# Altium schematic sheet WIFI_BLE.SchDoc
size A2; DrawnBy: UKAYACIK; Engineer: UKAYACIK; DocumentNumber: 19; Revision: B; SheetNumber: 19; SheetTotal: 21
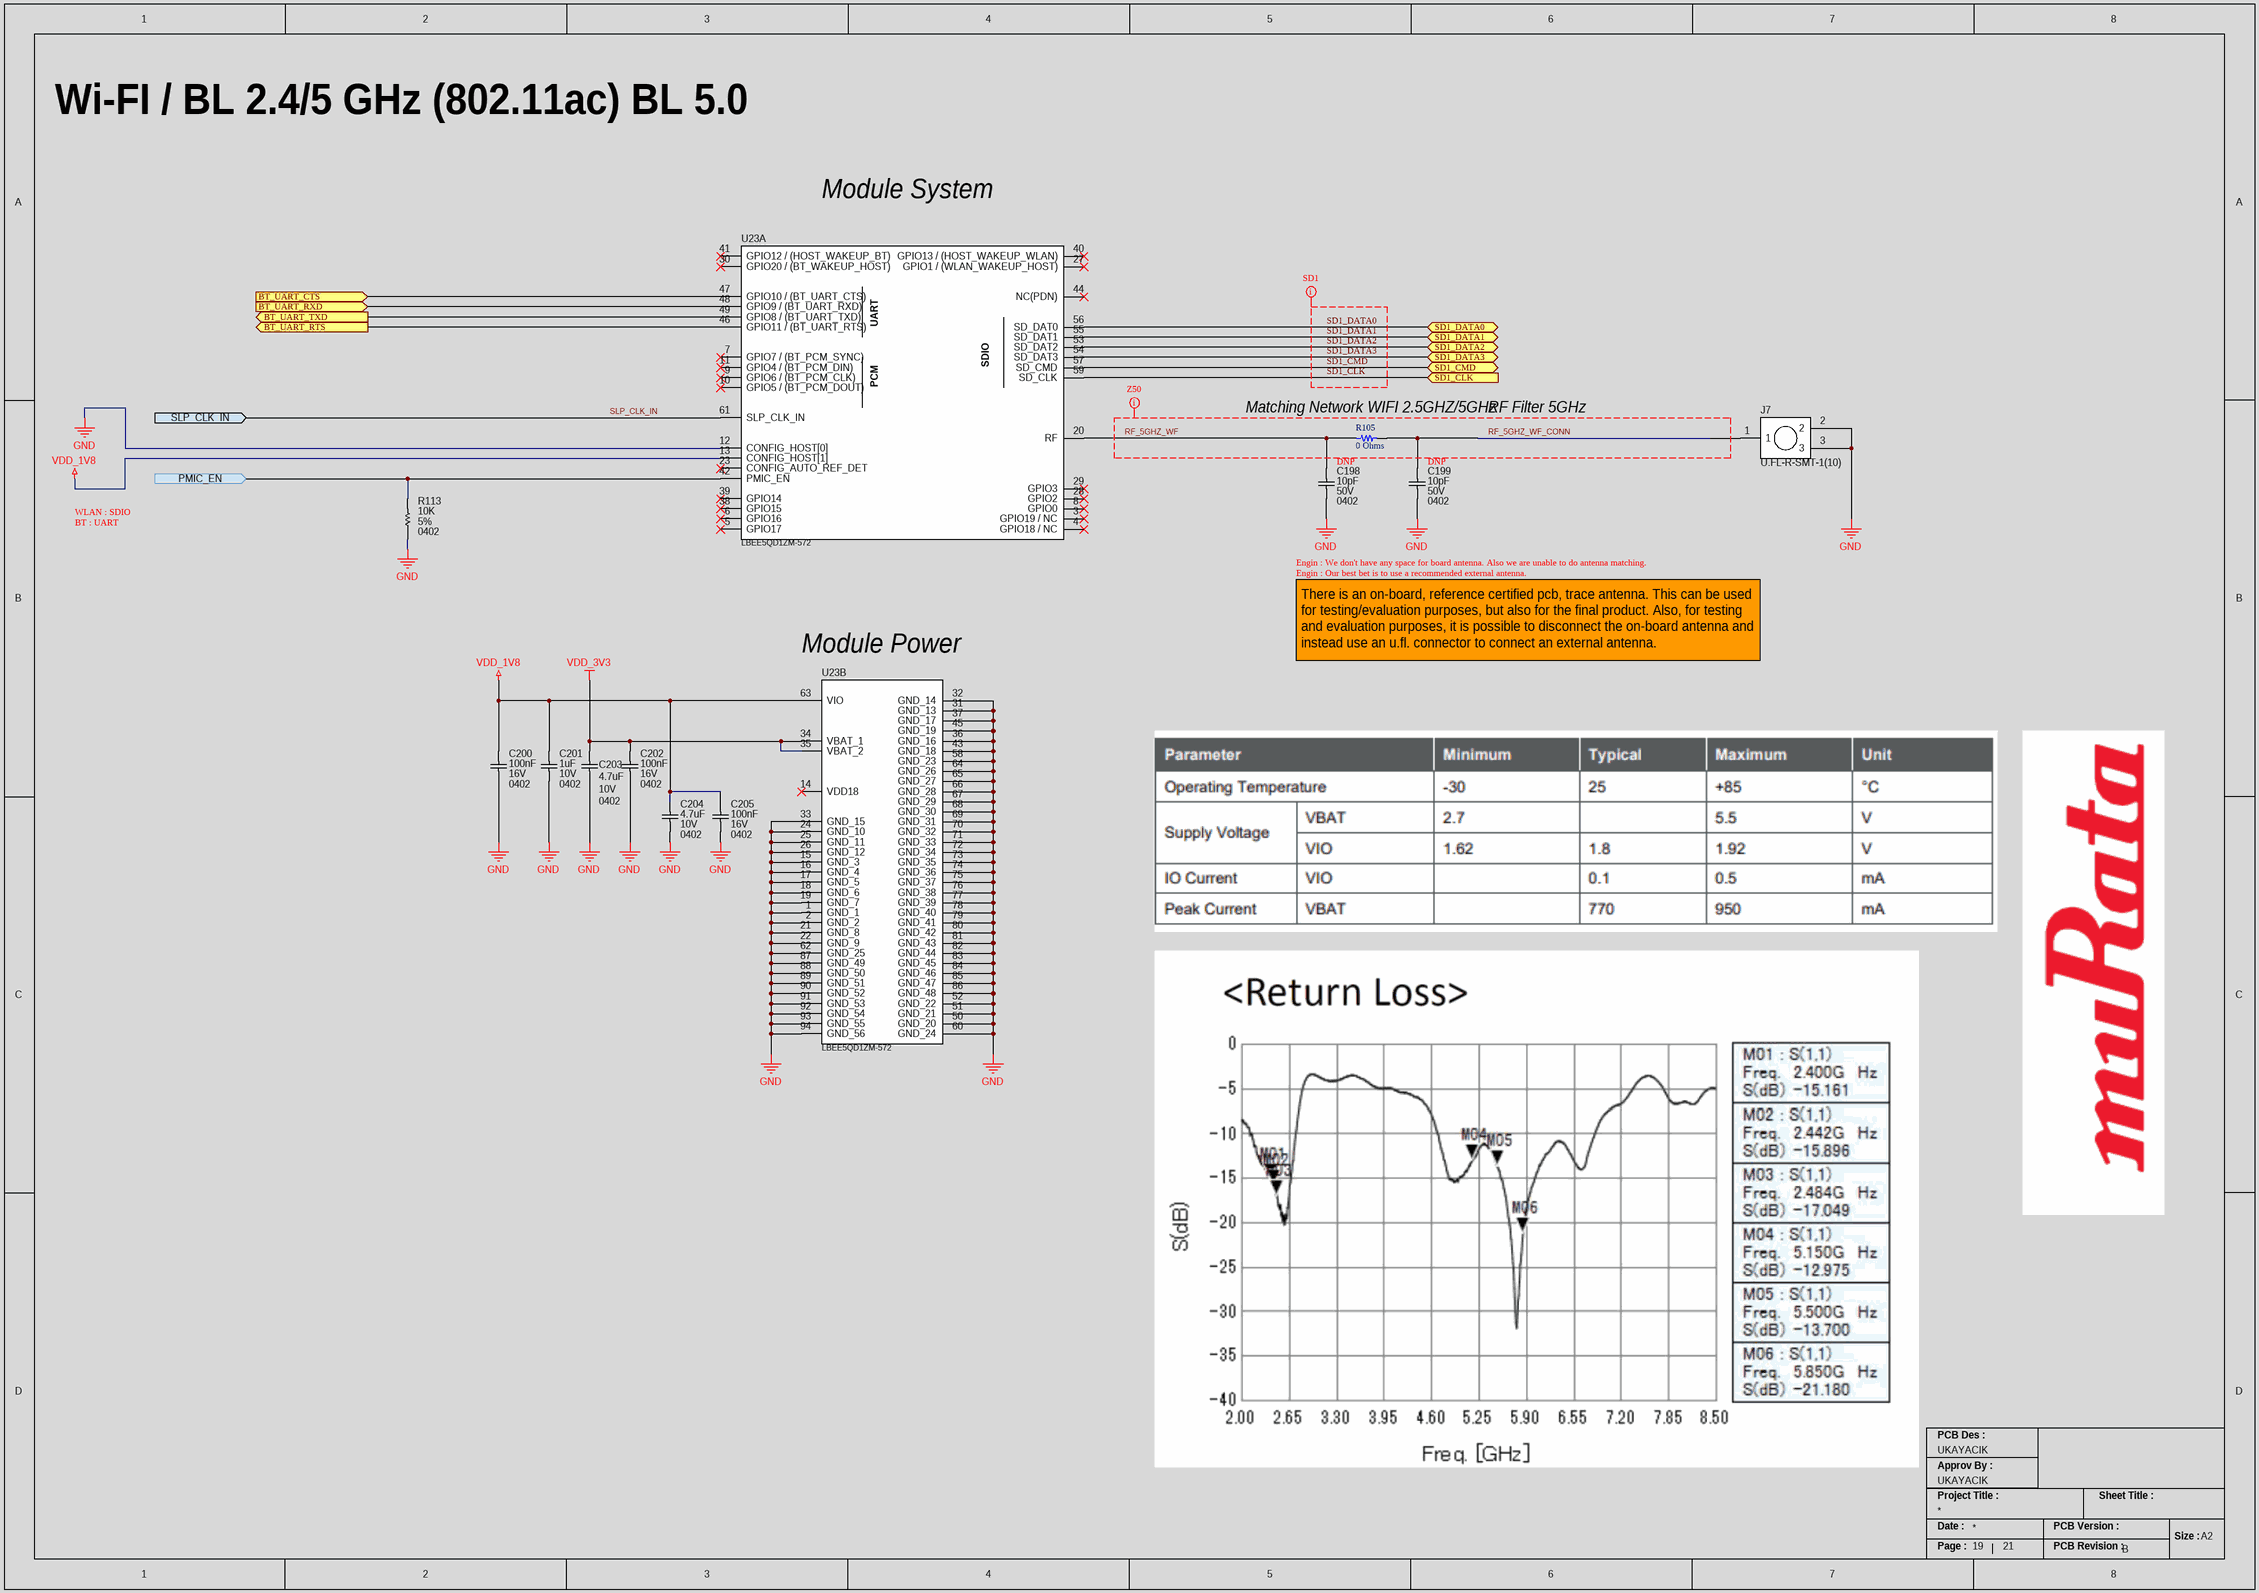
[diagram p0: WIFI_BLE.SchDoc]

## Parts
C198  Case/Package: 0402  Voltage Rating: 50V  Capacitance: 10pF  [CAP_0402_CAPC1005X05N]  (hidden comment: GJM1555C1H100FB01D)
C199  Case/Package: 0402  Voltage Rating: 50V  Capacitance: 10pF  [CAP_0402_CAPC1005X05N]  (hidden comment: GJM1555C1H100FB01D)
C200  Voltage Rating: 16V  Capacitance: 100nF  Case/Package: 0402  [CAP_0402_CAPC1005X05N]  (hidden comment: CL05B104KO5NNNC)
C201  Voltage Rating: 10V  Capacitance: 1uF  Case/Package: 0402  [CAP_0402_CAPC1005X05N]  (hidden comment: GRM155C81A105KA12D)
C202  Voltage Rating: 16V  Capacitance: 100nF  Case/Package: 0402  [CAP_0402_CAPC1005X05N]  (hidden comment: CL05B104KO5NNNC)
C203  Capacitance: 4.7uF  Voltage Rating: 10V  Case/Package: 0402  [CAP_0402_CAPC1005X05N]  (hidden comment: CL05A475KP5NRNC)
C204  Capacitance: 4.7uF  Voltage Rating: 10V  Case/Package: 0402  [CAP_0402_CAPC1005X05N]  (hidden comment: CL05A475KP5NRNC)
C205  Voltage Rating: 16V  Capacitance: 100nF  Case/Package: 0402  [CAP_0402_CAPC1005X05N]  (hidden comment: CL05B104KO5NNNC)
J7  U.FL-R-SMT-1(10)  [CONN_UFL_U.FL-R-SMT-1(10)]
R105  0 Ohms  [RES 0402_1005]
R113  Tolerance: 5%  Resistance: 10K  Case/Package: 0402  [RES_0402_RESC1005X04N]  (hidden comment: ERJ-2GEJ103X)
U23  LBEE5QD1ZM-572  [IC_WIFI_BLE_LBEE5QD1ZM572]  (parts A,B of 2)

## Ports
BT_UART_CTS (in), BT_UART_RTS (out), BT_UART_RXD (in), BT_UART_TXD (out), PMIC_EN (in), SD1_CLK (in), SD1_CMD (bidir), SD1_DATA0 (bidir), SD1_DATA1 (bidir), SD1_DATA2 (bidir), SD1_DATA3 (bidir), SLP_CLK_IN (in)

## Nets
GND: C198.1 C199.1 C200.1 C201.1 C202.1 C203.1 C204.1 C205.1 J7.2 J7.3 R113.1 U23.1(GND_1) U23.2(GND_2) U23.12(CONFIG_HOST[0]) U23.15(GND_3) U23.16(GND_4) U23.17(GND_5) U23.18(GND_6) U23.19(GND_7) U23.21(GND_8) U23.22(GND_9) U23.24(GND_10) U23.25(GND_11) U23.26(GND_12) U23.31(GND_13) U23.32(GND_14) U23.33(GND_15) U23.36(GND_16) U23.37(GND_17) U23.43(GND_18) U23.45(GND_19) U23.50(GND_20) U23.51(GND_21) U23.52(GND_22) U23.58(GND_23) U23.60(GND_24) U23.62(GND_25) U23.64(GND_26) U23.65(GND_27) U23.66(GND_28) U23.67(GND_29) U23.68(GND_30) U23.69(GND_31) U23.70(GND_32) U23.71(GND_33) U23.72(GND_34) U23.73(GND_35) U23.74(GND_36) U23.75(GND_37) U23.76(GND_38) U23.77(GND_39) U23.78(GND_40) U23.79(GND_41) U23.80(GND_42) U23.81(GND_43) U23.82(GND_44) U23.83(GND_45) U23.84(GND_46) U23.85(GND_47) U23.86(GND_48) U23.87(GND_49) U23.88(GND_50) U23.89(GND_51) U23.90(GND_52) U23.91(GND_53) U23.92(GND_54) U23.93(GND_55) U23.94(GND_56)
VDD_1V8: C200.2 C201.2 C204.2 C205.2 U23.13(CONFIG_HOST[1]) U23.63(VIO)
VDD_3V3: C202.2 C203.2 U23.34(VBAT_1) U23.35(VBAT_2)
BT_UART_CTS: U23.47(GPIO10_/_(BT_UART_CTS)) ; port BT_UART_CTS
BT_UART_RTS: U23.46(GPIO11_/_(BT_UART_RTS)) ; port BT_UART_RTS
BT_UART_RXD: U23.48(GPIO9_/_(BT_UART_RXD)) ; port BT_UART_RXD
BT_UART_TXD: U23.49(GPIO8_/_(BT_UART_TXD)) ; port BT_UART_TXD
PMIC_EN: R113.2 U23.42(PMIC_EN) ; port PMIC_EN
RF_5GHZ_WF: C198.2 R105.1 U23.20(RF)
RF_5GHZ_WF_CONN: C199.2 J7.1 R105.2
SD1_CLK: U23.59(SD_CLK) ; port SD1_CLK
SD1_CMD: U23.57(SD_CMD) ; port SD1_CMD
SD1_DATA0: U23.56(SD_DAT0) ; port SD1_DATA0
SD1_DATA1: U23.55(SD_DAT1) ; port SD1_DATA1
SD1_DATA2: U23.53(SD_DAT2) ; port SD1_DATA2
SD1_DATA3: U23.54(SD_DAT3) ; port SD1_DATA3
SLP_CLK_IN: U23.61(SLP_CLK_IN) ; port SLP_CLK_IN

Not connected (* = marked no-connect by the designer): U23 3(GPIO19_/_NC)* 4(GPIO18_/_NC)* 5(GPIO17)* 6(GPIO16)* 7(GPIO7_/_(BT_PCM_SYNC)_)* 8(GPIO0)* 9(GPIO6_/_(BT_PCM_CLK))* 10(GPIO5_/_(BT_PCM_DOUT))* 11(GPIO4_/_(BT_PCM_DIN))* 14(VDD18)* 23(CONFIG_AUTO_REF_DET)* 27(GPIO1_/_(WLAN_WAKEUP_HOST))* 28(GPIO2)* 29(GPIO3)* 30(GPIO20_/_(BT_WAKEUP_HOST))* 38(GPIO15)* 39(GPIO14)* 40(GPIO13_/_(HOST_WAKEUP_WLAN))* 41(GPIO12_/_(HOST_WAKEUP_BT))* 44(NC(PDN))*

## Layout directives
net class Z50: RF_5GHZ_WF, RF_5GHZ_WF_CONN
net class MICROSD1: SD1_CLK, SD1_CMD, SD1_DATA0, SD1_DATA1, SD1_DATA2, SD1_DATA3

## Notes on the sheet
- Wi-FI / BL 2.4/5 GHz (802.11ac) BL 5.0
- Module System
- (near R105) Matching Network WIFI 2.5GHZ/5GHz
- RF Filter 5GHz
- DNP
- (near C199) DNP
- WLAN : SDIO
- BT : UART
- Engin : We don't have any space for board antenna. Also we are unable to do antenna matching.
- Engin : Our best bet is to use a recommended external antenna.
- Module Power
- There is an on-board, reference certified pcb, trace antenna. This can be used for testing/evaluation purposes, but also for the final product. Also, for testing and evaluation purposes, it is possible to disconnect the on-board antenna and instead use an u.fl. connector to connect an external antenna.
- PCB Des :
- Approv By :
- Project Title :
- Sheet Title :
- Date :
- Page :
- PCB Version :
- PCB Revision :
- Size :
- A2
- (in symbol IC_WIFI_BLE_LBEE5QD1ZM-572, part A) UART; SDIO; PCM

## Library data of the parts
C198 C199 = CAP_10PF_50V_NP0_0402: Multilayer Ceramic Capacitor, 10 pF, 50 V, ± 1%, C0G (NP0), 0402 [1005 Metric]; Manufacturer: Murata; Material: 4241ConductorMaterial; Temperature Coefficient: 30ppm/°C; Supplier 1: Digikey; Manufacturer Part Number: GJM1555C1H100FB01D; RoHS: Yes; Category: Ceramic Capacitors; Stock 1: 104534; Pricing 1: 1=0.17, 10=0.113, 50=0.0676, 100=0.0532, 500=0.03926, 1000=0.03251, 2500=0.03026, 5000=0.02768 (USD); Mount: Surface Mount; Case Code (Imperial): 0402; Case Code (Metric): 1005; Weight: 2.3E-05oz; Min Operating Temperature: -55°C; Max Operating Temperature: 125°C; Packaging: Tape and Reel; Tolerance: 1%; Voltage Rating (DC): 50V; Dielectric: C0G; Termination: SMD/SMT; Voltage: 50V; Series: GJM; Construction: Flat; Length: 1mm; Width: 0.02inch; Height: 0.5mm; Thickness: 0.022inch; Depth: 0.5mm; Radiation Hardening: No; Reach SVHC Compliant: No; Lead Free: Lead Free; RoHS Compliant: Yes; ComponentLink1URL: https://datasheet.ciiva.com/11607/c02e-11607390.pdf?src-supplier=Avnet; ComponentLink1Description: https://datasheet.ciiva.com/11607/c02e-11607390.pdf?src-supplier=Avnet; Supplier Part Number 1: 490-11189-1-ND
C200 C202 C205 = CAP_100NF_16V_X7R_0402: Multilayer Ceramic Capacitor, 0.1 uF, 16 V, ± 10%, X7R, 0402 [1005 Metric]; Manufacturer: Samsung; Supplier 1: Digi-Key; Manufacturer Part Number: CL05B104KO5NNNC; RoHS: Yes; Category: Ceramic Capacitors; Stock 1: 11081064; Pricing 1: 1=0.1, 10=0.024, 50=0.013, 100=0.0105, 500=0.00752, 1000=0.00592, 2500=0.00538, 5000=0.00495 (USD); Mount: Surface Mount; Case Code (Metric): 1005; Case Code (Imperial): 0402; Material: Ceramic; Min Operating Temperature: -55°C; Max Operating Temperature: 125°C; Tolerance: 10%; Package Quantity: 1; Packaging: Tape and Reel; Dielectric: X7R; Series: CL; Voltage: 16V; Voltage Rating (DC): 16V; Construction: Flat; Length: 1mm; Width: 0.02inch; Height: 0.5mm; Thickness: 0.022inch; Depth: 0.5mm; Radiation Hardening: No; RoHS Compliant: Yes; Lead Free: Lead Free; ComponentLink1URL: https://datasheet.ciiva.com/26920/getdatasheetpartid-359683-26920169.pdf?src-supplier=Verical; ComponentLink1Description: https://datasheet.ciiva.com/26920/getdatasheetpartid-359683-26920169.pdf?src-supplier=Verical; ComponentLink2URL: https://datasheet.ciiva.com/29198/458718-da-01-en-vs-kondensator-0402-29198423.pdf?src-supplier=Conrad; ComponentLink2Description: https://datasheet.ciiva.com/29198/458718-da-01-en-vs-kondensator-0402-29198423.pdf?src-supplier=Conrad; ComponentLink3URL: https://datasheet.ciiva.com/16208/cl05b104kq5nnnc-16208343.pdf?src-supplier=Future+Electronics; ComponentLink3Description: https://datasheet.ciiva.com/16208/cl05b104kq5nnnc-16208343.pdf?src-supplier=Future+Electronics; ComponentLink4URL: https://datasheet.ciiva.com/26309/mlcc-catalogdownload2013-eng-26309003.pdf?src-supplier=Distrelec; ComponentLink4Description: https://datasheet.ciiva.com/26309/mlcc-catalogdownload2013-eng-26309003.pdf?src-supplier=Distrelec; Supplier Part Number 1: 1276-1001-6-ND
C201 = CAP_1UF_10V_X6S_0402: 0402 10 V 1 uF ±10% Tolerance X6S Multilayer Ceramic Capacitor; Manufacturer: Murata; Supplier 1: Digikey; Manufacturer Part Number: GRM155C81A105KA12D; RoHS: Yes; Category: Ceramic Capacitors; Stock 1: 2486564; Pricing 1: 1=0.1, 10=0.045, 50=0.026, 100=0.0202, 500=0.01518, 1000=0.01192, 2500=0.01084, 5000=0.00997 (USD); Mount: Surface Mount; Case Code (Metric): 1005; Material: Ceramic; Case Code (Imperial): 0402; Weight: 0.000212oz; Min Operating Temperature: -55°C; Max Operating Temperature: 105°C; Dielectric: X6S; Packaging: Tape and Reel; Termination: SMD/SMT; Voltage Rating (DC): 10V; Package Quantity: 10000; Series: GRM; Length: 1mm; Width: 0.5mm; Height: 0.5mm; Thickness: 0.022inch; Lead Free: Lead Free; RoHS Compliant: Yes; ComponentLink1URL: http://www.mouser.com/ds/2/281/c02e-2905.pdf?src-supplier=Mouser; ComponentLink1Description: http://www.mouser.com/ds/2/281/c02e-2905.pdf?src-supplier=Mouser; ComponentLink2URL: https://datasheet.octopart.com/GRM155C81A105KA12D-Murata-datasheet-22122223.pdf?src-supplier=Future+Electronics; ComponentLink2Description: https://datasheet.octopart.com/GRM155C81A105KA12D-Murata-datasheet-22122223.pdf?src-supplier=Future+Electronics; ComponentLink3URL: https://datasheet.octopart.com/GRM155C81A105KA12D-Murata-datasheet-149522926.pdf?src-supplier=Newark; ComponentLink3Description: https://datasheet.octopart.com/GRM155C81A105KA12D-Murata-datasheet-149522926.pdf?src-supplier=Newark; ComponentLink4URL: http://search.murata.co.jp/Ceramy/image/img/A01X/G101/ENG/GRM155C81A105KA12-01.pdf?src-supplier=Digikey; ComponentLink4Description: http://search.murata.co.jp/Ceramy/image/img/A01X/G101/ENG/GRM155C81A105KA12-01.pdf?src-supplier=Digikey; ComponentLink5URL: http://search.murata.co.jp/Ceramy/image/img/A01X/partnumbering_e_01.pdf?src-supplier=Digikey; ComponentLink5Description: http://search.murata.co.jp/Ceramy/image/img/A01X/partnumbering_e_01.pdf?src-supplier=Digikey; ComponentLink6URL: https://datasheet.octopart.com/GRM155C81A105KA12D-Murata-datasheet-165579666.pdf?src-supplier=TME; ComponentLink6Description: https://datasheet.octopart.com/GRM155C81A105KA12D-Murata-datasheet-165579666.pdf?src-supplier=TME; Supplier Part Number 1: 490-12699-6-ND; Tolerance: 10%
C203 C204 = CAP_4.7UF_10V_X5R_0402: Multilayer Ceramic Capacitor, 4.7 uF, 10 V, ± 10%, X5R, 0402 [1005 Metric]; Manufacturer: Samsung; Supplier 1: Digikey; Manufacturer Part Number: CL05A475KP5NRNC; RoHS: Yes; Category: Ceramic Capacitors; Stock 1: 748042; Pricing 1: 1=0.28, 10=0.184, 50=0.129, 100=0.1042, 500=0.0774, 1000=0.06772, 2500=0.0645, 5000=0.05966 (USD); Mount: Surface Mount; Case Code (Metric): 1005; Case Code (Imperial): 0402; Material: Ceramic; Min Operating Temperature: -55°C; Max Operating Temperature: 85°C; Tolerance: 10%; Packaging: Tape and Reel; Package Quantity: 1; Dielectric: X5R; Series: CL; Construction: Flat; Length: 1mm; Width: 0.02inch; Height: 0.5mm; Thickness: 0.022inch; Depth: 0.5mm; Radiation Hardening: No; RoHS Compliant: Yes; Lead Free: Lead Free; ComponentLink1URL: https://datasheet.ciiva.com/25724/cl05a475kp5nrnc-25724404.pdf?src-supplier=Digikey; ComponentLink1Description: https://datasheet.ciiva.com/25724/cl05a475kp5nrnc-25724404.pdf?src-supplier=Digikey; ComponentLink2URL: https://datasheet.ciiva.com/29198/458873-da-01-en-vs-kondensator-0402-29198304.pdf?src-supplier=Conrad; ComponentLink2Description: https://datasheet.ciiva.com/29198/458873-da-01-en-vs-kondensator-0402-29198304.pdf?src-supplier=Conrad; Supplier Part Number 1: 1276-1480-1-ND
J7 = CONN_UFL_RF_5OR_U.FL-R-SMT-1(10): RF Connector, 1 Contact(s), Male, Board Mount, Surface Mount Terminal, Receptacle; Manufacturer: Hirose; Body Material: Bronze; Body Plating: Silver; Dielectric Material: Polymer; Center Contact Plating: Gold; Impedance: 50R; Connector Type: Receptacle,Male Pin; Max Frequency: 6GHz; Number of Ports: 1; Mating Cycles: 30; Insulation Resistance: 500MR; Supplier 1: Digikey; Manufacturer Part Number: U.FL-R-SMT-1(10); RoHS: Yes; Category: RF / Coaxial Connectors; Stock 1: 174716; Pricing 1: 1=1.26, 10=1.064, 25=1.0208, 50=0.9988, 100=0.9555, 250=0.8686, 500=0.78174, 1000=0.69488 (USD); Mount: Surface Mount; Contact Material: Brass; Housing Color: Beige; Weight: 0.001764oz; Min Operating Temperature: -40°C; Max Operating Temperature: 90°C; Packaging: Tape and Reel; Package Quantity: 2500; Fastening Type: SNAP-ON; Termination: Solder; Series: U.FL; Orientation: Straight; RoHS Compliant: Yes; Lead Free: 5697LeadFree; ComponentLink1URL: https://datasheet.ciiva.com/11762/0900766b8105243f-11762474.pdf?src-supplier=Rs; ComponentLink1Description: https://datasheet.ciiva.com/11762/0900766b8105243f-11762474.pdf?src-supplier=Rs; ComponentLink2URL: https://datasheet.ciiva.com/7651/91524-7651914.pdf?src-supplier=Element14; ComponentLink2Description: https://datasheet.ciiva.com/7651/91524-7651914.pdf?src-supplier=Element14; ComponentLink3URL: https://datasheet.ciiva.com/7651/91524-7651915.pdf?src-supplier=Element14; ComponentLink3Description: https://datasheet.ciiva.com/7651/91524-7651915.pdf?src-supplier=Element14; Supplier Part Number 1: H11891DKR-ND
R105 = RCG04020000Z0ED: RES 0 OHM JUMPER 1/16W 0402; Manufacturer: Vishay Dale; Power (Watts): 0.063W, 1/16W; Part Number: RCG04020000Z0ED; Value: 0 Ohms; ComponentLink1Description: Datasheet; ComponentLink1URL: http://www.vishay.com/docs/20047/rcge3.pdf; ComponentLink2Description: DigiKey Link; ComponentLink2URL: https://www.digikey.com/en/products/detail/vishay-dale/RCG04020000Z0ED/4172496; Composition: Thick Film; Device Package: 0402 (1005 Metric); Height - Seated (Max): 0.016" (0.40mm); LastUpdated: 2/9/2024 8:30:12 PM; Lifecycle Status: Active; Minimum Order: 1; Number of Terminations: 2; Operating Temperature: -55°C ~ 155°C; Package / Case: 0402 (1005 Metric); Packaging: TapeAndReel; PartId: 5041; Part Status: Active; Price: 0.01; Resistance: 0 Ohms; Series: RCG e3; Size / Dimension: 0.039" L x 0.020" W (1.00mm x 0.50mm); Supplier 1: DigiKey; Supplier Part Number 1: 541-1887-1-ND; Supplier Device Package: 402; Tolerance: Jumper
R113 = RES_10K_5%_100mW_0402: Res Thick Film 0402 10K Ohm 5% 1/10W ±200ppm/°C Molded SMD Punched Carrier T/R; Manufacturer: Panasonic; Power Rating: 100mW; Voltage Rating: 50V; Supplier 1: Digi-Key; Manufacturer Part Number: ERJ-2GEJ103X; RoHS: Yes; Category: Chip SMD Resistors; Stock 1: 4696986; Pricing 1: 1=0.1, 10=0.021, 50=0.0132, 100=0.011, 500=0.00744, 1000=0.00639, 5000=0.00464 (USD); Mount: Surface Mount; Contact Plating: Tin; Case Code (Metric): 1005; Case Code (Imperial): 0402; Size Code: 0402; Min Operating Temperature: -55°C; Max Operating Temperature: 155°C; Temperature Coefficient: 200ppm/°C; Packaging: Cut Tape; Resistor Type: Thick Film; Package Quantity: 10000; Number of Terminations: 2; Termination: SMD/SMT; Max Power Dissipation: 100mW; Features: Automotive AEC-Q200; Series: ERJ; Resistance Tolerance: 5%; Technology: THICK FILM; Voltage Rating (DC): 50V; Length: 1mm; Width: 0.5mm; Height: 0.35mm; Depth: 0.5mm; Ratings: AEC-Q200; Radiation Hardening: No; Reach SVHC Compliant: No; RoHS Compliant: Yes; Lead Free: 5697LeadFree; ComponentLink1URL: https://datasheet.ciiva.com/27055/1935721-27055112.pdf?src-supplier=Jameco; ComponentLink1Description: https://datasheet.ciiva.com/27055/1935721-27055112.pdf?src-supplier=Jameco; ComponentLink2URL: https://datasheet.ciiva.com/11821/0900766b80f806dd-11821170.pdf?src-supplier=Rs; ComponentLink2Description: https://datasheet.ciiva.com/11821/0900766b80f806dd-11821170.pdf?src-supplier=Rs; ComponentLink3URL: https://datasheet.ciiva.com/43460/1678796-43460391.pdf?src-supplier=Farnell; ComponentLink3Description: https://datasheet.ciiva.com/43460/1678796-43460391.pdf?src-supplier=Farnell; ComponentLink4URL: https://datasheet.ciiva.com/22785/1678796-22785949.pdf?src-supplier=Farnell; ComponentLink4Description: https://datasheet.ciiva.com/22785/1678796-22785949.pdf?src-supplier=Farnell; ComponentLink5URL: https://datasheet.ciiva.com/46371/1678796-46371910.pdf?src-supplier=Element14; ComponentLink5Description: https://datasheet.ciiva.com/46371/1678796-46371910.pdf?src-supplier=Element14; ComponentLink6URL: https://datasheet.ciiva.com/28514/1678796-28514154.pdf?src-supplier=Element14; ComponentLink6Description: https://datasheet.ciiva.com/28514/1678796-28514154.pdf?src-supplier=Element14; ComponentLink7URL: https://datasheet.ciiva.com/24070/aoa0000ce1-37422-24070679.pdf?src-supplier=Mouser; ComponentLink7Description: https://datasheet.ciiva.com/24070/aoa0000ce1-37422-24070679.pdf?src-supplier=Mouser; ComponentLink8URL: https://datasheet.ciiva.com/16767/70260739-16767130.pdf?src-supplier=Allied+Electronics; ComponentLink8Description: https://datasheet.ciiva.com/16767/70260739-16767130.pdf?src-supplier=Allied+Electronics; ComponentLink9URL: https://datasheet.ciiva.com/16774/70260739-16774504.pdf?src-supplier=Allied+Electronics; ComponentLink9Description: https://datasheet.ciiva.com/16774/70260739-16774504.pdf?src-supplier=Allied+Electronics; ComponentLink10URL: https://datasheet.ciiva.com/9194/aoa0000ce1-9194140.pdf?src-supplier=Avnet; ComponentLink10Description: https://datasheet.ciiva.com/9194/aoa0000ce1-9194140.pdf?src-supplier=Avnet; Supplier Part Number 1: P10KJCT-ND
U23 = IC_WIFI_BLE_LBEE5QD1ZM-572: 2.4 to 5.825GHz Bluetooth WiFi 802.11a/b/g/-c, Bluetooth v5.1 Transceiver Module; Manufacturer_Name: Murata Electronics; Manufacturer: Murata; Datasheet Link: https://pl.mouser.com/datasheet/2/281/1/murata_type1zm-2006876.pdf; Height: 1.345mm; Manufacturer_Part_Number: LBEE5QD1ZM-572; Mouser Part Number: 81-LBEE5QD1ZM-572; Mouser Price/Stock: https://www.mouser.co.uk/ProductDetail/Murata-Electronics/LBEE5QD1ZM-572?qs=stqOd1AaK79ZX7AUUzAj%2FQ%3D%3D; Arrow Part Number: LBEE5QD1ZM-572; Arrow Price/Stock: https://www.arrow.com/en/products/lbee5qd1zm-572/murata-manufacturing?region=nac; Supplier: Mouser; Supplier Part Number: 81-LBEE5QD1ZM-572; Manufacturer Part Number: LBEE5QD1ZM-572; RoHS: No; Stock: 926; Pricing: 1=17.82, 10=16.11, 25=14.82, 50=14.48, 100=13.43, 250=12.74, 500=11.95, 1000=11.35, 10000=11.35 (USD)